# EAGLE schematic RaspberryPiGamingBoard (EAGLE 9.6.2)
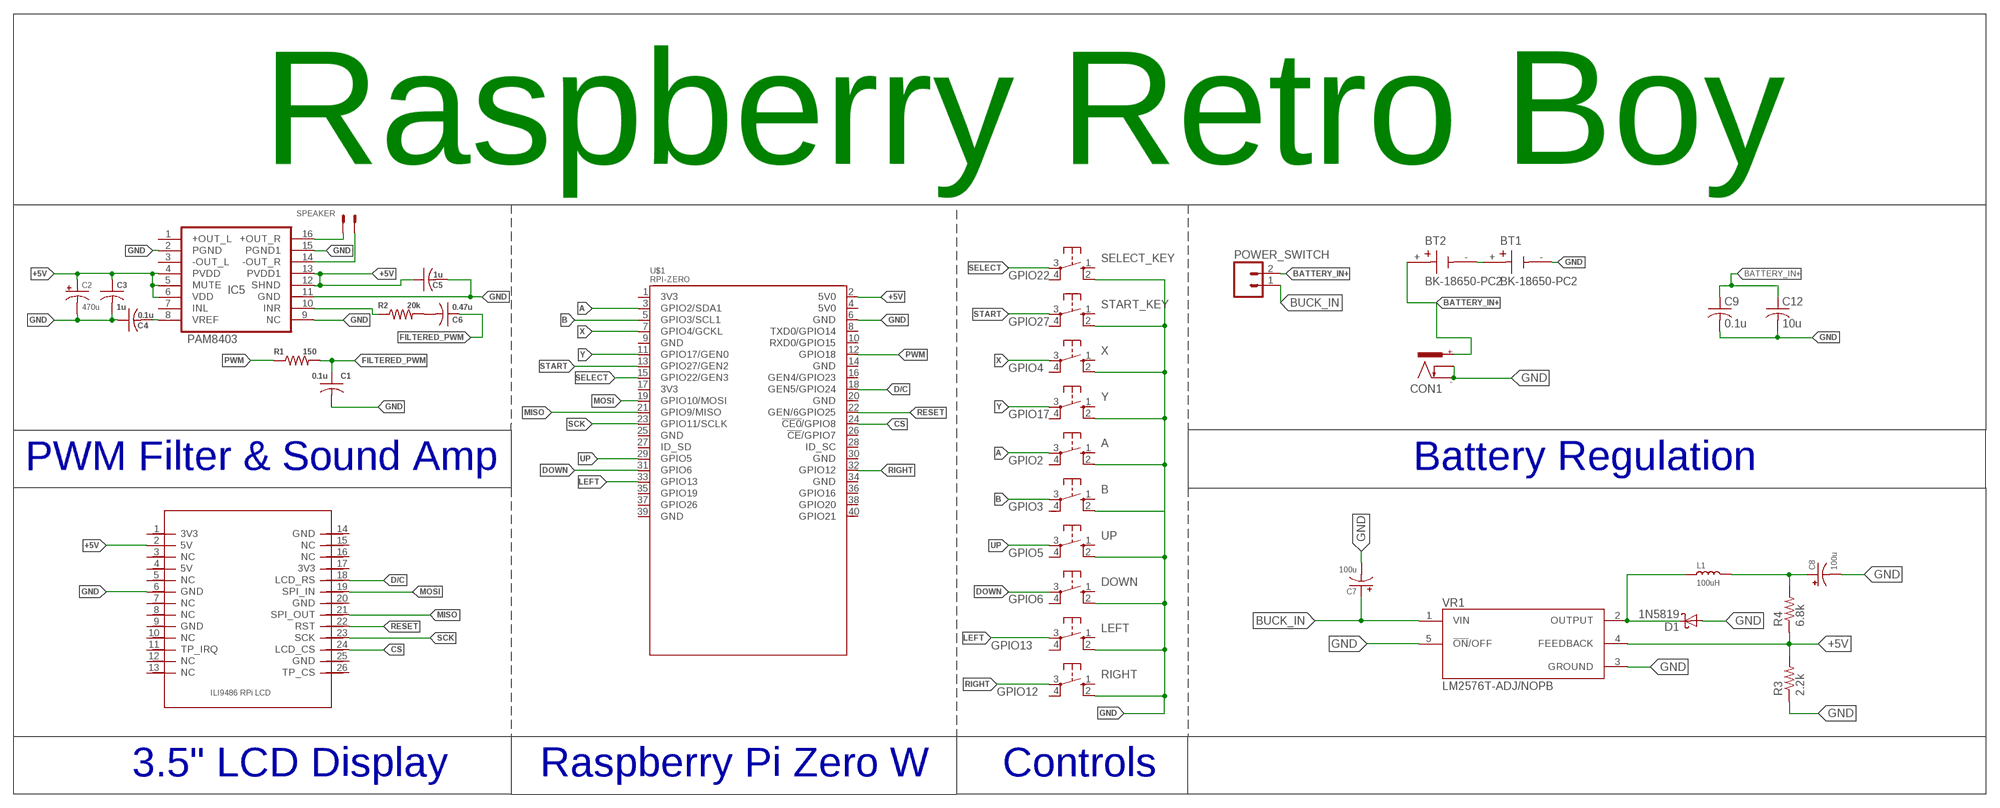
[diagram p0: schematic, sheet 1]

## Parts
A  40-XX  [B3F-40XX]
B  40-XX  [B3F-40XX]
BT1  BK-18650-PC2  [BAT_BK-18650-PC2]
BT2  BK-18650-PC2  [BAT_BK-18650-PC2]
C1  0.1u  CAP0603  [C0603]
C2  470u  CPOL-USE5-10.5  [E5-10,5]
C3  1u  CAP0805  [C0805]
C4  0.1u  CAP0805  [C0805]
C5  1u  CAP0805  [C0805]
C6  0.47u  CAP0603  [C0603]
C7  100u  CPOL-USE5-10.5  [E5-10,5]
C8  100u  CPOL-USE5-10.5  [E5-10,5]
C9  0.1u  CAP0805  [C0805]
C12  10u  CAP0805  [C0805]
CON1  POWER_CON  [NEB21R]
D1  1N5819  [DO41-10]
DOWN  40-XX  [B3F-40XX]
IC5  PAM8403  [SOP-16]
L1  100uH  INDUCTOR/FERRITE-BEAD6X8H  [INDUCTOR_INT2-3.5-D6.5XH8.0MM]
LEFT  40-XX  [B3F-40XX]
POWER_SWITCH  M02  [02P]
R1  150  R-US_0207/10  [0207/10]
R2  20k  R-US_0207/10  [0207/10]
R3  2.2k  RESISTOR0207/7  [0207/7]
R4  6.8k  RESISTOR0207/7  [0207/7]
RIGHT  40-XX  [B3F-40XX]
SELECT_KEY  40-XX  [B3F-40XX]
SPEAKER  SPEAKER  JST-XH-02-PIN-LONG-PAD  [JST-XH-02-PACKAGE-LONG-PAD]
START_KEY  40-XX  [B3F-40XX]
U$1  RPI-ZERO  [RASP_PI_ZERO_BOARD_FULL]
U$2  3.5INCHRPIDISPLAY  [3.5INCH_RPI_LCD]
UP  40-XX  [B3F-40XX]
VR1  LM2576T-ADJ/NOPB  [TO170P1067X483X1651-5]
X  40-XX  [B3F-40XX]
Y  40-XX  [B3F-40XX]

## Nets
+5V [POWER]: C2.+ C3.1 C5.1 IC5.4(PVDD) IC5.5(MUTE) IC5.6(VDD) IC5.12(SHND) IC5.13(PVDD1) R3.2 R4.1 U$1.2(5V0) U$2.2(5V) VR1.4(FEEDBACK)
BATTERY_IN+: BT2.+ C9.1 C12.1 CON1.+ POWER_SWITCH.2
BUCK_IN: C7.+ POWER_SWITCH.1 VR1.1(VIN)
FILTERED_PWM: C1.1 C6.1 R1.2
GND: A.2(S1) B.2(S1) BT1.- C1.2 C2.- C3.2 C4.1 C5.2 C7.- C8.- C9.2 C12.2 CON1.- CON1.C D1.A DOWN.2(S1) IC5.2(PGND) IC5.9(NC) IC5.11(GND) IC5.15(PGND1) LEFT.2(S1) R3.1 RIGHT.2(S1) SELECT_KEY.2(S1) START_KEY.2(S1) U$1.6(GND) U$2.6(GND) UP.2(S1) VR1.3(GROUND) VR1.5(!ON!/OFF) X.2(S1) Y.2(S1)
GPIO2: A.3(P) U$1.3(GPIO2/SDA1)
GPIO3: B.3(P) U$1.5(GPIO3/SCL1)
GPIO4: U$1.7(GPIO4/GCKL) X.3(P)
GPIO5: U$1.29(GPIO5) UP.3(P)
GPIO6: DOWN.3(P) U$1.31(GPIO6)
GPIO8: U$1.24(!CE0!/GPIO8) U$2.24(LCD_CS)
GPIO9: U$1.21(GPIO9/MISO) U$2.21(SPI_OUT)
GPIO10: U$1.19(GPIO10/MOSI) U$2.19(SPI_IN)
GPIO11: U$1.23(GPIO11/SCLK) U$2.23(SCK)
GPIO12: RIGHT.3(P) U$1.32(GPIO12)
GPIO13: LEFT.3(P) U$1.33(GPIO13)
GPIO17: U$1.11(GPIO17/GEN0) Y.3(P)
GPIO18: R1.1 U$1.12(GPIO18)
GPIO22: SELECT_KEY.3(P) U$1.15(GPIO22/GEN3)
GPIO24: U$1.18(GEN5/GPIO24) U$2.18(LCD_RS)
GPIO25: U$1.22(GEN/6GPIO25) U$2.22(RST)
GPIO27: START_KEY.3(P) U$1.13(GPIO27/GEN2)
N$1: IC5.16(+OUT_R) SPEAKER.2
N$2: BT1.+ BT2.-
N$3: D1.C L1.1 VR1.2(OUTPUT)
N$5: IC5.14(-OUT_R) SPEAKER.1
N$7: C4.2 IC5.8(VREF)
N$8: C6.2 R2.2
N$10: IC5.10(INR) R2.1
N$14: C8.+ L1.2 R4.2
Unconnected: A.1(S) A.4(P1) B.1(S) B.4(P1) DOWN.1(S) DOWN.4(P1) IC5.1(+OUT_L) IC5.3(-OUT_L) IC5.7(INL) LEFT.1(S) LEFT.4(P1) RIGHT.1(S) RIGHT.4(P1) SELECT_KEY.1(S) SELECT_KEY.4(P1) START_KEY.1(S) START_KEY.4(P1) U$1.1(3V3) U$1.4(5V0) U$1.8(TXD0/GPIO14) U$1.9(GND) U$1.10(RXD0/GPIO15) U$1.14(GND) U$1.16(GEN4/GPIO23) U$1.17(3V3) U$1.20(GND) U$1.25(GND) U$1.26(!CE!/GPIO7) U$1.27(ID_SD) U$1.28(ID_SC) U$1.30(GND) U$1.34(GND) U$1.35(GPIO19) U$1.36(GPIO16) U$1.37(GPIO26) U$1.38(GPIO20) U$1.39(GND) U$1.40(GPIO21) U$2.1(3V3) U$2.3(NC) U$2.4(5V) U$2.5(NC) U$2.7(NC) U$2.8(NC) U$2.9(GND) U$2.10(NC) U$2.11(TP_IRQ) U$2.12(NC) U$2.13(NC) U$2.14(GND) U$2.15(NC) U$2.16(NC) U$2.17(3V3) U$2.20(GND) U$2.25(GND) U$2.26(TP_CS) UP.1(S) UP.4(P1) X.1(S) X.4(P1) Y.1(S) Y.4(P1)

## Notes on the sheet
- Raspberry Retro Boy
- PWM Filter & Sound Amp | Battery Regulation
- 3.5" LCD Display | Raspberry Pi Zero W | Controls

## Library data of the parts
A B DOWN LEFT RIGHT SELECT_KEY START_KEY UP X Y = adafruit:40-XX: OMRON SWITCH; MF: OMRON COMPONENTS USA; MPN: B3F-4000; OC_FARNELL: 176434; OC_NEWARK: 36K3105
BT1 BT2 = BK-18650-PC2:BK-18650-PC2: Battery Holder (Open) 18650 1 Cell PC Pin Check availability <https://pricing.snapeda.com/parts/BK-18650-PC2/MPD%20%28Memory%20Protection%20Devices%29/view-part?ref=eda>; AVAILABILITY: In Stock; DESCRIPTION: Battery Holder (Open) 18650 1 Cell PC Pin; MF: MPD (Memory Protection Devices); MP: BK-18650-PC2; PACKAGE: None; PRICE: None; PURCHASE-URL: https://pricing.snapeda.com/search/part/BK-18650-PC2/?ref=eda
C1 C3-C6 = CEDT_JANUARY_2015_v5:CAP
C2 C7 C8 = rcl:CPOL-US: POLARIZED CAPACITOR, American symbol; SPICEPREFIX: C
C9 C12 = CEDT_JANUARY_2015_v6:CAP
CON1 = CEDT_JANUARY_2015_v6:POWER_CON: DC Power Connector
D1 = CEDT_JANUARY_2015_v6:1N5819: DIODE general purpose rectifier, 1 A
IC5 = PAM8403:PAM8403: Dual channel audio amplifier IC - PAM8403
L1 = BeagleBone_Blue_R3:INDUCTOR/FERRITE-BEAD
POWER_SWITCH = CEDT_JANUARY_2015_v6:M02: AMP QUICK CONNECTOR
R1 R2 = rcl:R-US_: RESISTOR, American symbol; SPICEPREFIX: R
R3 R4 = CEDT_JANUARY_2015_v6:RESISTOR
SPEAKER = Rembrandt Electronics - JST XH Connectors v1-0:JST-XH-02-PIN: JST XH Connector 2 Pin Wire to board connector. Pitch: 2,54 mm, (0.100") Number of pins: 2 Created by Rembrandt Electronics www.rembrandtelectronics.com
U$1 = rpi-zero:RPI-ZERO
U$2 = CEDT_JANUARY_2015_v6:3.5INCHRPIDISPLAY: 3.5inch Waveshare LCD Display for RaspberryPi
VR1 = LM2576T-ADJ_NOPB:LM2576T-ADJ/NOPB: SIMPLE SWITCHER® 40V, 3A Low Component Count Step-Down Regulator Check availability <https://pricing.snapeda.com/parts/LM2576T-ADJ/NOPB/Texas%20Instruments/view-part?ref=eda>; AVAILABILITY: In Stock; DESCRIPTION: SIMPLE SWITCHER&reg; 40V, 3A Low Component Count Step-Down Regulator; MF: Texas Instruments; MP: LM2576T-ADJ/NOPB; PACKAGE: TO-220-5 Texas Instruments; PRICE: None; PURCHASE-URL: https://pricing.snapeda.com/search/part/LM2576T-ADJ/NOPB/?ref=eda

## Net classes
0 default: width 0.406 mm
1 POWER: width 0.711 mm, drill 0.7 mm, clearance 0.25 mm